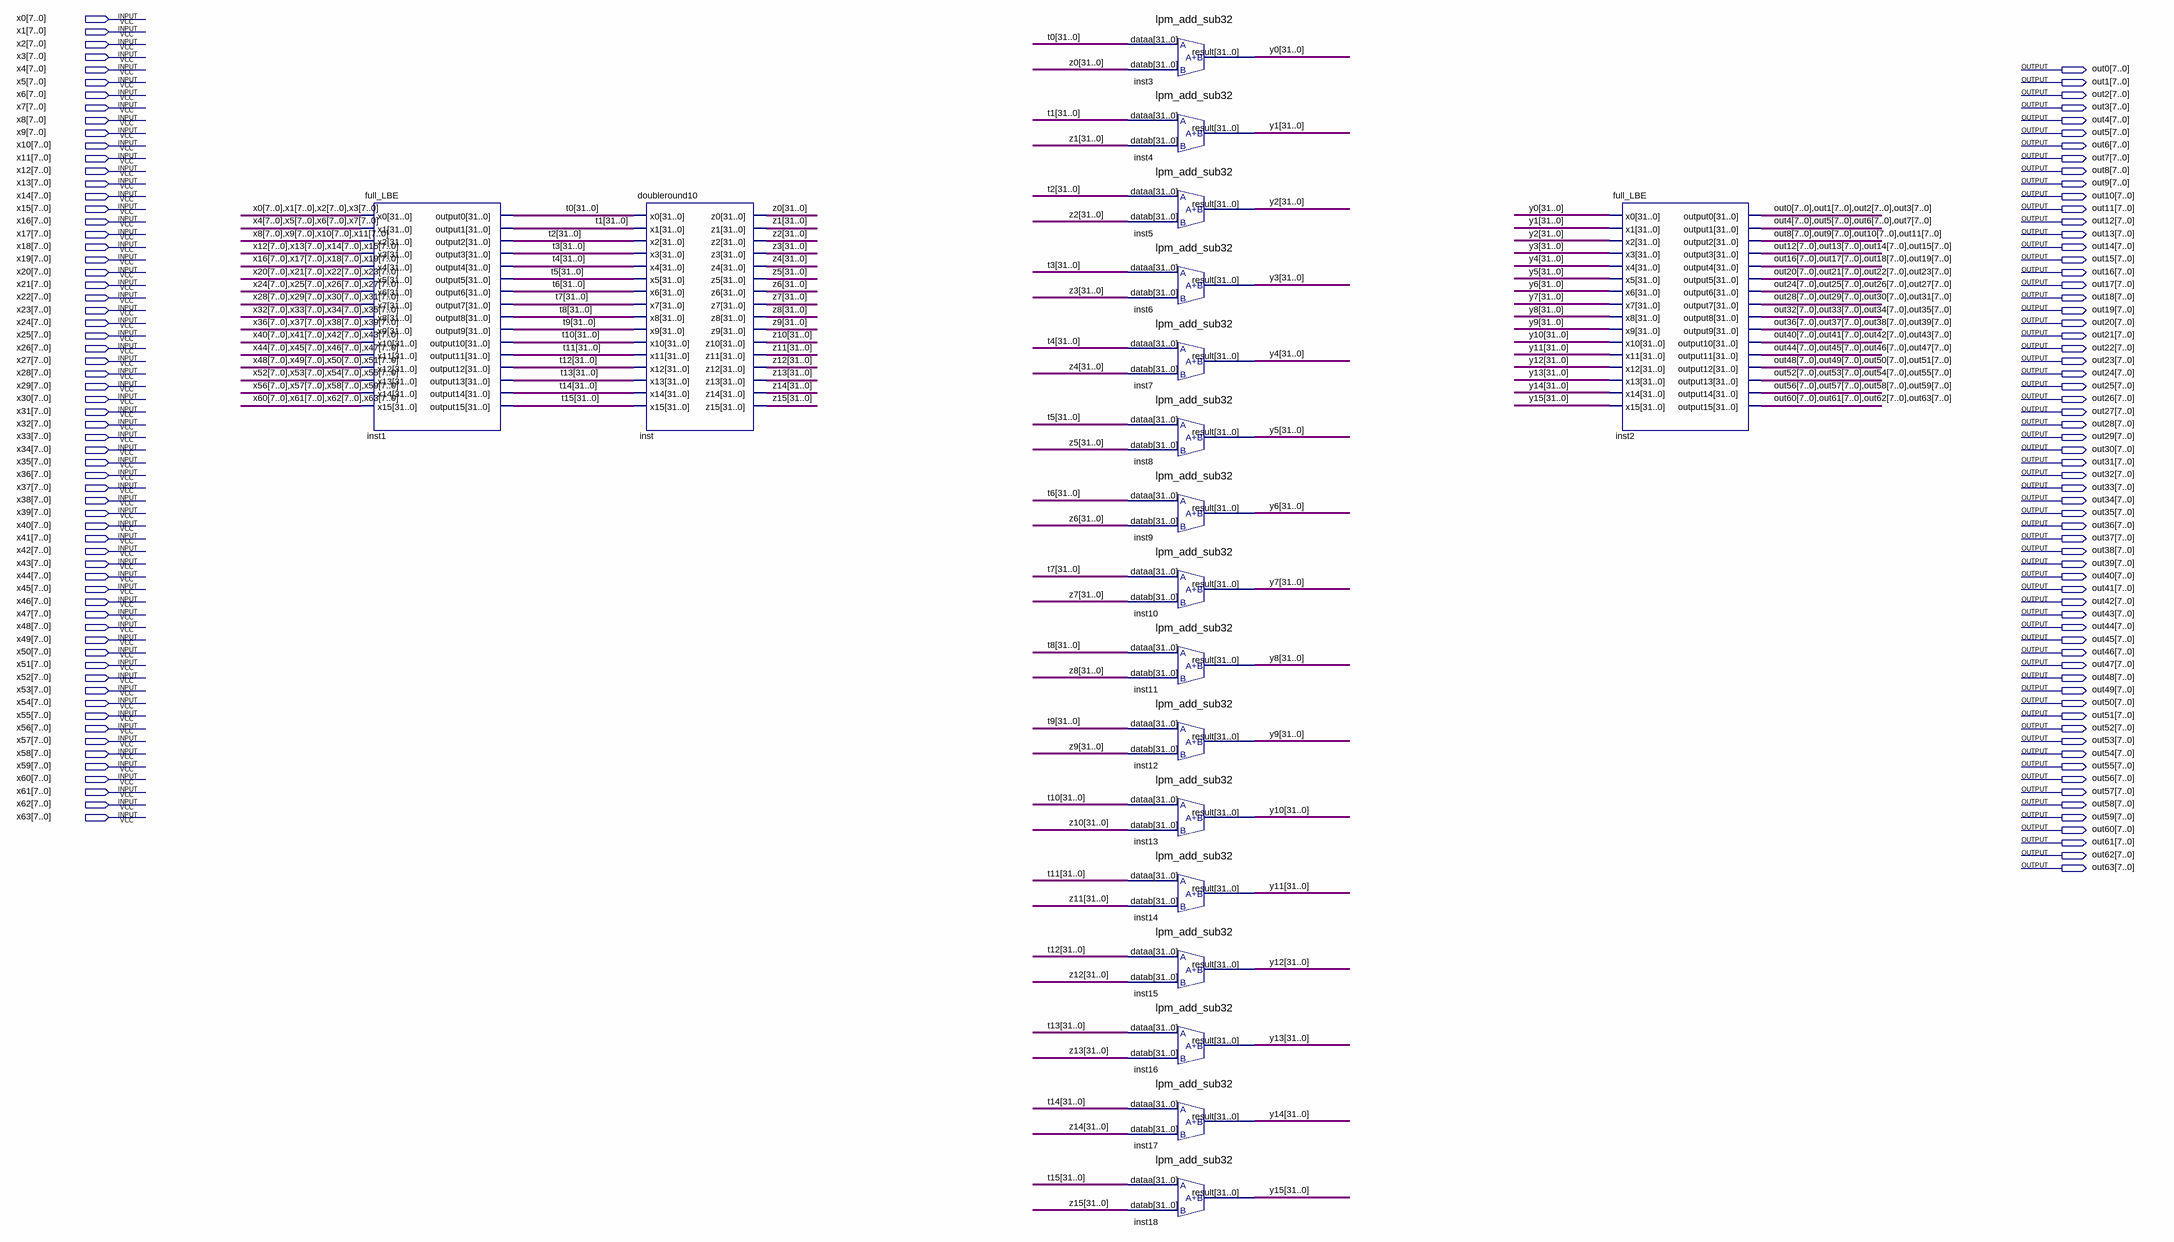
[diagram p0: schematic sheet]
// Quartus schematic Salsa20_default.bdf as structural Verilog: 19 symbols, 128 pins
module Salsa20_default (
  input  [7:0] x0,
  input  [7:0] x1,
  input  [7:0] x2,
  input  [7:0] x3,
  input  [7:0] x4,
  input  [7:0] x5,
  input  [7:0] x6,
  input  [7:0] x7,
  input  [7:0] x8,
  input  [7:0] x9,
  input  [7:0] x10,
  input  [7:0] x11,
  input  [7:0] x12,
  input  [7:0] x13,
  input  [7:0] x14,
  input  [7:0] x15,
  input  [7:0] x16,
  input  [7:0] x17,
  input  [7:0] x18,
  input  [7:0] x19,
  input  [7:0] x20,
  input  [7:0] x21,
  input  [7:0] x22,
  input  [7:0] x23,
  input  [7:0] x24,
  input  [7:0] x25,
  input  [7:0] x26,
  input  [7:0] x27,
  input  [7:0] x28,
  input  [7:0] x29,
  input  [7:0] x30,
  input  [7:0] x31,
  input  [7:0] x32,
  input  [7:0] x33,
  input  [7:0] x34,
  input  [7:0] x35,
  input  [7:0] x36,
  input  [7:0] x37,
  input  [7:0] x38,
  input  [7:0] x39,
  input  [7:0] x40,
  input  [7:0] x41,
  input  [7:0] x42,
  input  [7:0] x43,
  input  [7:0] x44,
  input  [7:0] x45,
  input  [7:0] x46,
  input  [7:0] x47,
  input  [7:0] x48,
  input  [7:0] x49,
  input  [7:0] x50,
  input  [7:0] x51,
  input  [7:0] x52,
  input  [7:0] x53,
  input  [7:0] x54,
  input  [7:0] x55,
  input  [7:0] x56,
  input  [7:0] x57,
  input  [7:0] x58,
  input  [7:0] x59,
  input  [7:0] x60,
  input  [7:0] x61,
  input  [7:0] x62,
  input  [7:0] x63,
  output [7:0] out0,
  output [7:0] out1,
  output [7:0] out2,
  output [7:0] out3,
  output [7:0] out4,
  output [7:0] out5,
  output [7:0] out6,
  output [7:0] out7,
  output [7:0] out8,
  output [7:0] out9,
  output [7:0] out10,
  output [7:0] out11,
  output [7:0] out12,
  output [7:0] out13,
  output [7:0] out14,
  output [7:0] out15,
  output [7:0] out16,
  output [7:0] out17,
  output [7:0] out18,
  output [7:0] out19,
  output [7:0] out20,
  output [7:0] out21,
  output [7:0] out22,
  output [7:0] out23,
  output [7:0] out24,
  output [7:0] out25,
  output [7:0] out26,
  output [7:0] out27,
  output [7:0] out28,
  output [7:0] out29,
  output [7:0] out30,
  output [7:0] out31,
  output [7:0] out32,
  output [7:0] out33,
  output [7:0] out34,
  output [7:0] out35,
  output [7:0] out36,
  output [7:0] out37,
  output [7:0] out38,
  output [7:0] out39,
  output [7:0] out40,
  output [7:0] out41,
  output [7:0] out42,
  output [7:0] out43,
  output [7:0] out44,
  output [7:0] out45,
  output [7:0] out46,
  output [7:0] out47,
  output [7:0] out48,
  output [7:0] out49,
  output [7:0] out50,
  output [7:0] out51,
  output [7:0] out52,
  output [7:0] out53,
  output [7:0] out54,
  output [7:0] out55,
  output [7:0] out56,
  output [7:0] out57,
  output [7:0] out58,
  output [7:0] out59,
  output [7:0] out60,
  output [7:0] out61,
  output [7:0] out62,
  output [7:0] out63
);

  wire [31:0] t0, t1, t2, t3, t4, t5, t6, t7, t8, t9, t10, t11, t12, t13, t14, t15, y0, y1, y2, y3, y4, y5,
       y6, y7, y8, y9, y10, y11, y12, y13, y14, y15, z0, z1, z2, z3, z4, z5, z6, z7, z8, z9, z10, z11, z12,
       z13, z14, z15;

  full_LBE inst1 (
    .x0({x0, x1, x2, x3}), .x1({x4, x5, x6, x7}), .x2({x8, x9, x10, x11}), .x3({x12, x13, x14, x15}),
    .x4({x16, x17, x18, x19}), .x5({x20, x21, x22, x23}), .x6({x24, x25, x26, x27}),
    .x7({x28, x29, x30, x31}), .x8({x32, x33, x34, x35}), .x9({x36, x37, x38, x39}),
    .x10({x40, x41, x42, x43}), .x11({x44, x45, x46, x47}), .x12({x48, x49, x50, x51}),
    .x13({x52, x53, x54, x55}), .x14({x56, x57, x58, x59}), .x15({x60, x61, x62, x63}), .output0(t0),
    .output1(t1), .output2(t2), .output3(t3), .output4(t4), .output5(t5), .output6(t6), .output7(t7),
    .output8(t8), .output9(t9), .output10(t10), .output11(t11), .output12(t12), .output13(t13),
    .output14(t14), .output15(t15));
  doubleround10 inst (
    .x0(t0), .x1(t1), .x2(t2), .x3(t3), .x4(t4), .x5(t5), .x6(t6), .x7(t7), .x8(t8), .x9(t9), .x10(t10),
    .x11(t11), .x12(t12), .x13(t13), .x14(t14), .x15(t15), .z0(z0), .z1(z1), .z2(z2), .z3(z3), .z4(z4),
    .z5(z5), .z6(z6), .z7(z7), .z8(z8), .z9(z9), .z10(z10), .z11(z11), .z12(z12), .z13(z13), .z14(z14),
    .z15(z15));
  lpm_add_sub32 inst3 (.dataa(t0), .datab(z0), .result(y0));
  lpm_add_sub32 inst4 (.dataa(t1), .datab(z1), .result(y1));
  lpm_add_sub32 inst5 (.dataa(t2), .datab(z2), .result(y2));
  lpm_add_sub32 inst6 (.dataa(t3), .datab(z3), .result(y3));
  lpm_add_sub32 inst7 (.dataa(t4), .datab(z4), .result(y4));
  lpm_add_sub32 inst8 (.dataa(t5), .datab(z5), .result(y5));
  lpm_add_sub32 inst9 (.dataa(t6), .datab(z6), .result(y6));
  lpm_add_sub32 inst10 (.dataa(t7), .datab(z7), .result(y7));
  lpm_add_sub32 inst11 (.dataa(t8), .datab(z8), .result(y8));
  lpm_add_sub32 inst12 (.dataa(t9), .datab(z9), .result(y9));
  lpm_add_sub32 inst13 (.dataa(t10), .datab(z10), .result(y10));
  lpm_add_sub32 inst14 (.dataa(t11), .datab(z11), .result(y11));
  lpm_add_sub32 inst15 (.dataa(t12), .datab(z12), .result(y12));
  lpm_add_sub32 inst16 (.dataa(t13), .datab(z13), .result(y13));
  lpm_add_sub32 inst17 (.dataa(t14), .datab(z14), .result(y14));
  lpm_add_sub32 inst18 (.dataa(t15), .datab(z15), .result(y15));
  full_LBE inst2 (
    .x0(y0), .x1(y1), .x2(y2), .x3(y3), .x4(y4), .x5(y5), .x6(y6), .x7(y7), .x8(y8), .x9(y9), .x10(y10),
    .x11(y11), .x12(y12), .x13(y13), .x14(y14), .x15(y15), .output0({out0, out1, out2, out3}),
    .output1({out4, out5, out6, out7}), .output2({out8, out9, out10, out11}),
    .output3({out12, out13, out14, out15}), .output4({out16, out17, out18, out19}),
    .output5({out20, out21, out22, out23}), .output6({out24, out25, out26, out27}),
    .output7({out28, out29, out30, out31}), .output8({out32, out33, out34, out35}),
    .output9({out36, out37, out38, out39}), .output10({out40, out41, out42, out43}),
    .output11({out44, out45, out46, out47}), .output12({out48, out49, out50, out51}),
    .output13({out52, out53, out54, out55}), .output14({out56, out57, out58, out59}),
    .output15({out60, out61, out62, out63}));
endmodule
